# EAGLE design discodolly (EAGLE 9.3.2)
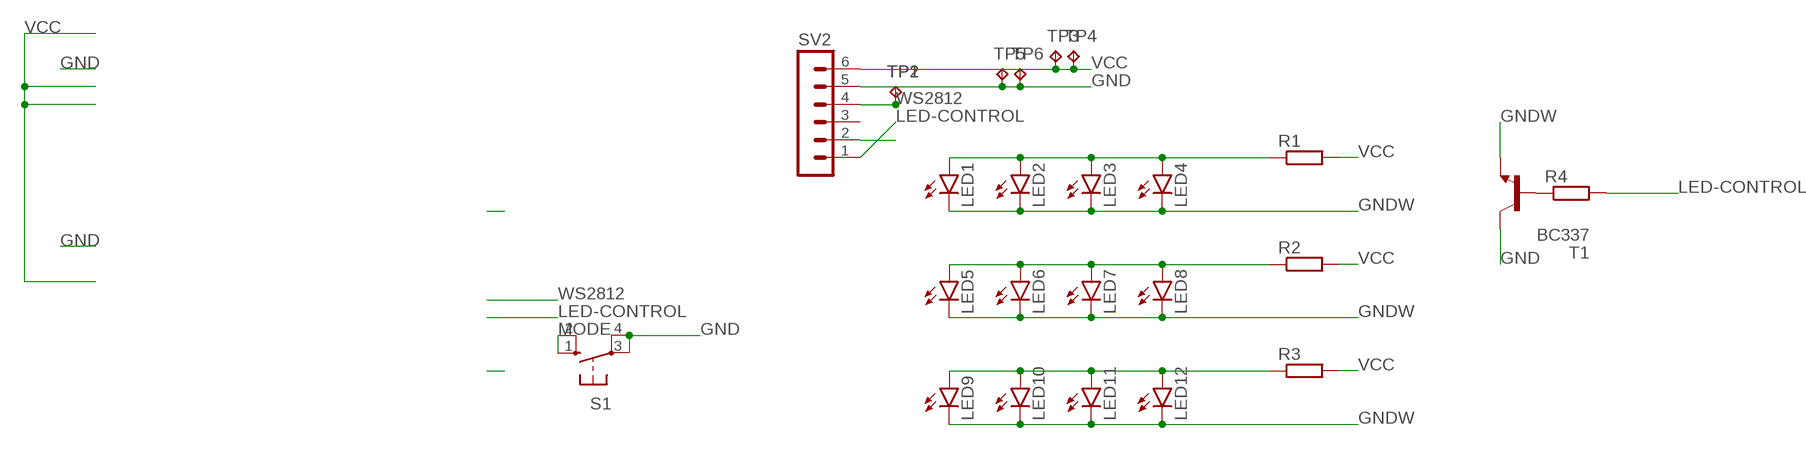
[diagram p0: schematic, sheet 1]

## Parts
LED1  LEDCHIPLED_1206  [CHIPLED_1206]
LED2  LEDCHIPLED_1206  [CHIPLED_1206]
LED3  LEDCHIPLED_1206  [CHIPLED_1206]
LED4  LEDCHIPLED_1206  [CHIPLED_1206]
LED5  LEDCHIPLED_1206  [CHIPLED_1206]
LED6  LEDCHIPLED_1206  [CHIPLED_1206]
LED7  LEDCHIPLED_1206  [CHIPLED_1206]
LED8  LEDCHIPLED_1206  [CHIPLED_1206]
LED9  LEDCHIPLED_1206  [CHIPLED_1206]
LED10  LEDCHIPLED_1206  [CHIPLED_1206]
LED11  LEDCHIPLED_1206  [CHIPLED_1206]
LED12  LEDCHIPLED_1206  [CHIPLED_1206]
R1  R-EU_M1206  [M1206]
R2  R-EU_M1206  [M1206]
R3  R-EU_M1206  [M1206]
R4  R-EU_M1206  [M1206]
S1  10-XX  [B3F-10XX]
SV2  MA06-1  [MA06-1]
T1  BC337  [TO92]
TP1  TPTP20SQ  [TP20SQ]
TP2  TPTP20SQ  [TP20SQ]
TP3  TPTP20SQ  [TP20SQ]
TP4  TPTP20SQ  [TP20SQ]
TP5  TPTP20SQ  [TP20SQ]
TP6  TPTP20SQ  [TP20SQ]

## Nets
GND: S1.3(P) S1.4(P1) SV2.5 T1.3(C) TP5.TP TP6.TP
GNDW: LED1.C LED2.C LED3.C LED4.C LED5.C LED6.C LED7.C LED8.C LED9.C LED10.C LED11.C LED12.C T1.1(E)
LED-CONTROL: R4.2 SV2.1
MODE: S1.1(S) S1.2(S1) SV2.2
N$1: LED1.A LED2.A LED3.A LED4.A R1.1
N$2: LED5.A LED6.A LED7.A LED8.A R2.1
N$3: LED9.A LED10.A LED11.A LED12.A R3.1
N$4: R4.1 T1.2(B)
VCC: R1.2 R2.2 R3.2 SV2.6 TP3.TP TP4.TP
WS2812: SV2.4 TP1.TP TP2.TP
Unconnected: SV2.3

## Library data of the parts
LED1-LED12 = led:LED: LED OSRAM: - CHIPLED LG R971, LG N971, LY N971, LG Q971, LY Q971, LO R971, LY R971 LH N974, LH R974 LS Q976, LO Q976, LY Q976 LO Q996 - Hyper CHIPLED LW Q18S LB Q993, LB Q99A, LB R99A - SideLED LS A670, LO A670, LY A670, LG A670, LP A670 LB A673, LV A673, LT A673, LW A673 LH A674 LY A675 LS A676, LA A676, LO A676, LY A676, LW A676 LS A679, LY A679, LG A679 - Hyper Micro SIDELED® LS Y876, LA Y876, LO Y876, LY Y876 LT Y87S - SmartLED LW L88C, LW L88S LB L89C, LB L89S, LG L890 LS L89K, LO L89K, LY L89K LS L896, LA L896, LO L896, LY L896 - TOPLED LS T670, LO T670, LY T670, LG T670, LP T670 LSG T670, LSP T670, LSY T670, LOP T670, LYG T670 LG T671, LOG T671, LSG T671 LB T673, LV T673, LT T673, LW T673 LH T674 LS T676, LA T676, LO T676, LY T676, LB T676, LH T676, LSB T676, LW T676 LB T67C, LV T67C, LT T67C, LS T67K, LO T67K, LY T67K, LW E67C LS E67B, LA E67B, LO E67B, LY E67B, LB E67C, LV E67C, LT E67C LW T67C LS T679, LY T679, LG T679 LS T770, LO T770, LY T770, LG T770, LP T770 LB T773, LV T773, LT T773, LW T773 LH T774 LS E675, LA E675, LY E675, LS T675 LS T776, LA T776, LO T776, LY T776, LB T776 LHGB T686 LT T68C, LB T68C - Hyper Mini TOPLED® LB M676 - Mini TOPLED Santana® LG M470 LS M47K, LO M47K, LY M47K Source: http://www.osram.convergy.de LUXEON: - LUMILED® LXK2-PW12-R00, LXK2-PW12-S00, LXK2-PW14-U00, LXK2-PW14-V00 LXK2-PM12-R00, LXK2-PM12-S00, LXK2-PM14-U00 LXK2-PE12-Q00, LXK2-PE12-R00, LXK2-PE12-S00, LXK2-PE14-T00, LXK2-PE14-U00 LXK2-PB12-K00, LXK2-PB12-L00, LXK2-PB12-M00, LXK2-PB14-N00, LXK2-PB14-P00, LXK2-PB14-Q00 LXK2-PR12-L00, LXK2-PR12-M00, LXK2-PR14-Q00, LXK2-PR14-R00 LXK2-PD12-Q00, LXK2-PD12-R00, LXK2-PD12-S00 LXK2-PH12-R00, LXK2-PH12-S00 LXK2-PL12-P00, LXK2-PL12-Q00, LXK2-PL12-R00 Source: www.luxeon.com KINGBRIGHT: KA-3528ASYC Source: www.kingbright.com
R1-R4 = resistor:R-EU_: RESISTOR, European symbol
S1 = switch-omron:10-XX: OMRON SWITCH; MPN: B3F-1000; OC_FARNELL: 176432; OC_NEWARK: 36M3542
SV2 = con-lstb:MA06-1: PIN HEADER; OC_FARNELL: unknown; OC_NEWARK: unknown
T1 = transistor:BC337: NPN TRANSISTOR
TP1-TP6 = testpad:TP: Test pad

## Board
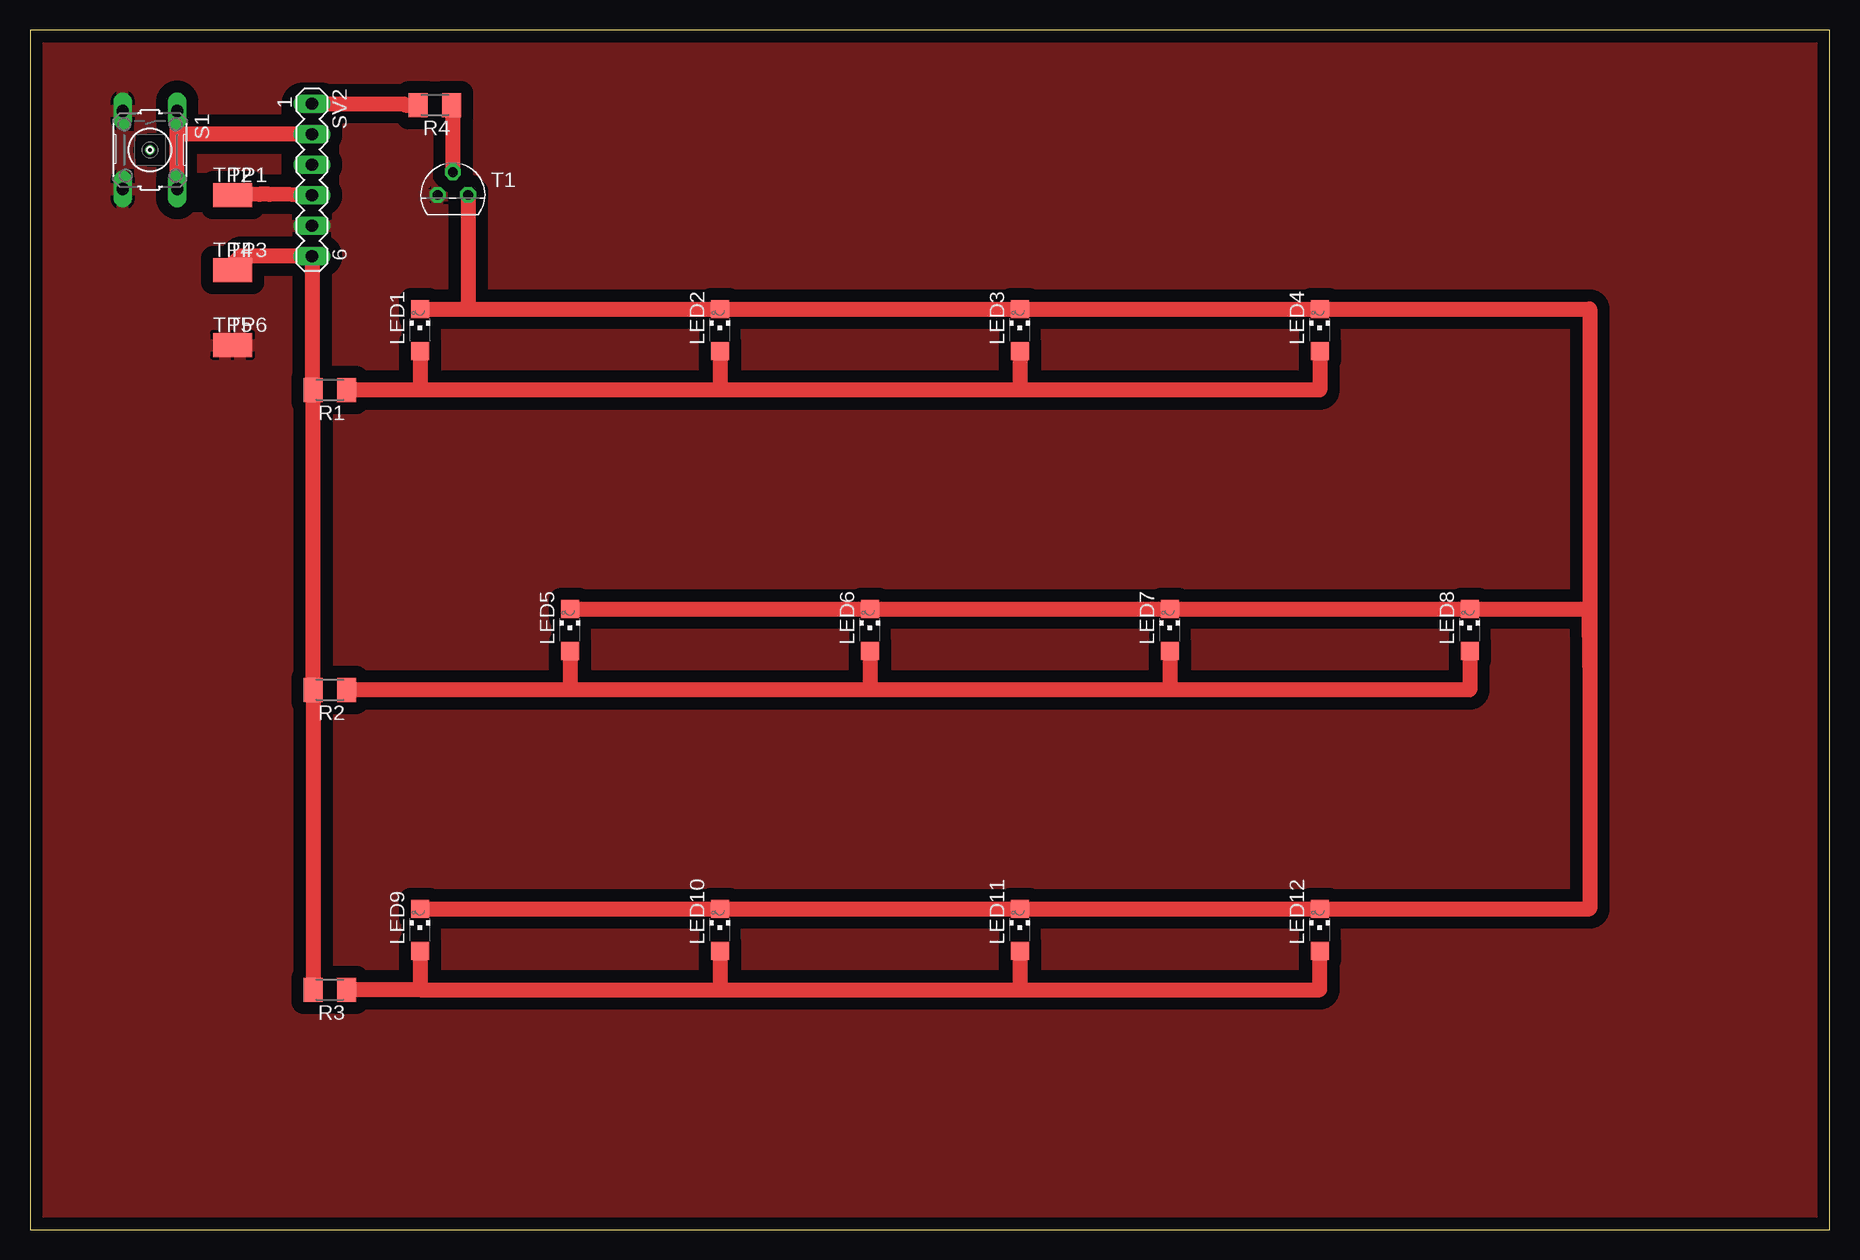
[diagram p1: board, top side]

Size 150 x 100 mm. Coordinates in mm from the lower left corner, seen from the top.
Outline: 0,0 150,0 150,100 0,100 0,0
Copper layers (1*16): Top 0.035mm / dielectric 1.5mm / Bottom 0.035mm
Design rules "default": minimum track width 6mil, minimum drill 0.35mm, track to track 6mil, track to pad 6mil, pad to pad 6mil, via to via 6mil, smd to smd 6mil, copper to edge 40mil, drill to drill 6mil, minimum pad ring 10mil, minimum via ring 8mil, stop-mask expansion 4mil, vias tented up to drill 0mil, thermal gap 10mil
Holes 0.35 mm at 10,90

### Footprints (pad centres in the part's own frame; a part is rotated, then mirrored left to right if it is on the bottom)
CHIPLED_1206 = smd 1.5 x 1.5: A 0,-1.75; C 0,1.75
M1206 = smd 1.6 x 2: 1 -1.4,0; 2 1.4,0
B3F-10XX = drill 1.016 long: 1 -3.251,2.261; 2 3.251,2.261; 3 -3.251,-2.261; 4 3.251,-2.261
MA06-1 = drill 1.016 long: 1 -6.35,0; 2 -3.81,0; 3 -1.27,0; 4 1.27,0; 5 3.81,0; 6 6.35,0
TO92 = drill 0.813 octagon: 1 1.27,0; 2 0,1.905; 3 -1.27,0
TP20SQ = smd 2 x 2: TP 0,0

### Placement (x,y rotation side)
LED1  32.5,75 0 top
LED2  57.5,75 0 top
LED3  82.5,75 0 top
LED4  107.5,75 0 top
LED5  45,50 0 top
LED6  70,50 0 top
LED7  95,50 0 top
LED8  120,50 0 top
LED9  32.5,25 0 top
LED10  57.5,25 0 top
LED11  82.5,25 0 top
LED12  107.5,25 0 top
R1  25,70 180 top
R2  25,45 180 top
R3  25,20 180 top
R4  33.75,93.75 180 top
S1  10,90 270 top
SV2  23.5,87.5 270 top
T1  35.25,86.25 0 top
TP1  17.5,86.25 0 top
TP2  16.25,86.25 0 top
TP3  17.5,80 0 top
TP4  16.25,80 0 top
TP5  16.25,73.75 0 top
TP6  17.5,73.75 0 top

### Tracks (layer width: path | path; a pad name or v marks a point on that pad's centre or on a via)
GND
  pour Top (isolate 1.016): 0,100 150,100 150,0 0,0
GNDW
  Top 1.27: LED1.C 36.25,76.75 | 36.25,76.75 LED2.C LED3.C LED4.C 130,76.75 130,47 | 130,47 130,26.75 LED12.C LED11.C LED10.C LED9.C | LED5.C LED6.C LED7.C LED8.C 129.99,51.75 130,47 | T1.1 36.52,77.02 36.25,76.75
LED-CONTROL
  Top 1.27: R4.2 31.25,93.75 31.15,93.85 SV2.1
MODE
  Top 1.27: SV2.2 12.56,91.31 | 12.56,91.31 12.5,91.25 | S1.2 12.26,91.25 | 12.26,91.25 S1.1 | 12.26,91.25 12.32,91.31 12.56,91.31
N$1
  Top 1.27: 82.5,70 107.5,70 LED4.A | 82.5,70 57.5,70 | 57.5,70 32.5,70 | 32.5,70 R1.1 | LED3.A 82.5,70 | LED2.A 57.5,70 | LED1.A 32.5,70
N$2
  Top 1.27: 95,45 120,45 LED8.A | 95,45 70,45 | 70,45 45,45 | 45,45 R2.1 | LED7.A 95,45 | LED6.A 70,45 | LED5.A 45,45
N$3
  Top 1.27: 32.5,20 R3.1 | 32.5,20 57.5,20 | 57.5,20 82.5,20 | 82.5,20 107.5,20 LED12.A | LED11.A 82.5,20 | LED10.A 57.5,20 | LED9.A 32.5,20
N$4
  Top 1.27: T1.2 35.25,93.65 R4.1
N$6  (via drill 0.35)
  other vias: 10,90
VCC
  Top 0.152: 17.6,81.15 17.6,80 TP3.TP
  Top 1.27: R3.2 R2.2 R1.2 23.5,70.1 SV2.6 17.6,81.15 TP4.TP
WS2812
  Top 0.152: TP2.TP TP1.TP
  Top 1.27: SV2.4 19.94,86.31 arc3 TP1.TP
(copper drawn outside any net)
  shapes: Top area x2